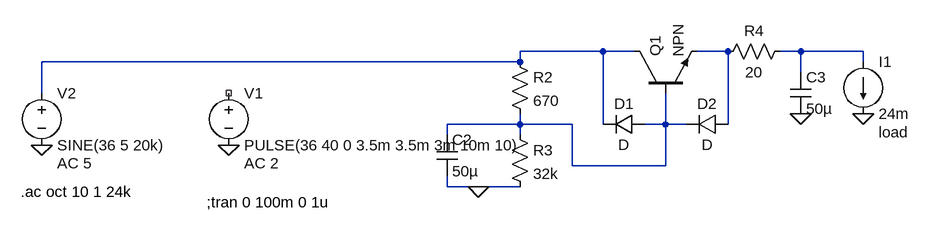
[diagram p0: schematic Draft1.asc]
Draft1.asc, the LTspice schematic file:
Version 4
SHEET 1 1212 680
WIRE 656 64 528 64
WIRE 704 64 656 64
WIRE 848 64 800 64
WIRE 960 64 928 64
WIRE 1056 64 960 64
WIRE 528 80 528 64
WIRE 528 80 -208 80
WIRE 1056 80 1056 64
WIRE 960 96 960 64
WIRE -208 128 -208 80
WIRE 528 176 528 160
WIRE 528 176 416 176
WIRE 608 176 528 176
WIRE 656 176 656 64
WIRE 752 176 752 128
WIRE 752 176 720 176
WIRE 784 176 752 176
WIRE 848 176 848 64
WIRE 416 192 416 176
WIRE 528 192 528 176
WIRE 608 240 608 176
WIRE 752 240 752 176
WIRE 752 240 608 240
WIRE 416 272 416 256
WIRE 464 272 416 272
WIRE 528 272 464 272
FLAG 960 160 0
FLAG 464 272 0
FLAG 80 208 0
FLAG 1056 160 0
FLAG -208 208 0
SYMBOL voltage 80 112 R0
WINDOW 123 24 124 Left 2
WINDOW 39 0 0 Left 0
SYMATTR InstName V1
SYMATTR Value PULSE(36 40 0 3.5m 3.5m 3m 10m 10)
SYMATTR Value2 AC 2
SYMBOL res 512 64 R0
SYMATTR InstName R2
SYMATTR Value 670
SYMBOL res 512 176 R0
SYMATTR InstName R3
SYMATTR Value 32k
SYMBOL cap 400 192 R0
SYMATTR InstName C2
SYMATTR Value 50µ
SYMBOL diode 720 160 R90
WINDOW 0 0 32 VBottom 2
WINDOW 3 32 32 VTop 2
SYMATTR InstName D1
SYMBOL diode 848 160 R90
WINDOW 0 0 32 VBottom 2
WINDOW 3 32 32 VTop 2
SYMATTR InstName D2
SYMBOL npn 704 128 R270
SYMATTR InstName Q1
SYMBOL res 944 48 R90
WINDOW 0 0 56 VBottom 2
WINDOW 3 32 56 VTop 2
SYMATTR InstName R4
SYMATTR Value 20
SYMBOL cap 944 96 R0
SYMATTR InstName C3
SYMATTR Value 50µ
SYMBOL current 1056 80 R0
WINDOW 123 0 0 Left 0
WINDOW 39 24 108 Left 2
SYMATTR InstName I1
SYMATTR Value 24m
SYMATTR SpiceLine load
SYMBOL voltage -208 112 R0
WINDOW 123 24 124 Left 2
WINDOW 39 0 0 Left 0
SYMATTR InstName V2
SYMATTR Value SINE(36 5 20k)
SYMATTR Value2 AC 5
TEXT 46 296 Left 2 !;tran 0 100m 0 1u
TEXT -240 280 Left 2 !.ac oct 10 1 24k

The netlist it stands for:
* Draft1.asc
V1 NC_01 0 PULSE(36 40 0 3.5m 3.5m 3m 10m 10) AC 2
R2 N001 N004 670
R3 N004 0 32k
C2 N004 0 50µ
D1 N004 N001 D
D2 N002 N004 D
Q1 N001 N004 N002 0 NPN
R4 N003 N002 20
C3 N003 0 50µ
I1 N003 0 24m load
V2 N001 0 SINE(36 5 20k) AC 5
.model D D
.lib standard.dio
.model NPN NPN
.model PNP PNP
.lib standard.bjt
;tran 0 100m 0 1u
.ac oct 10 1 24k
.backanno
.end